# Altium project ESP32_breakout.PrjPcb
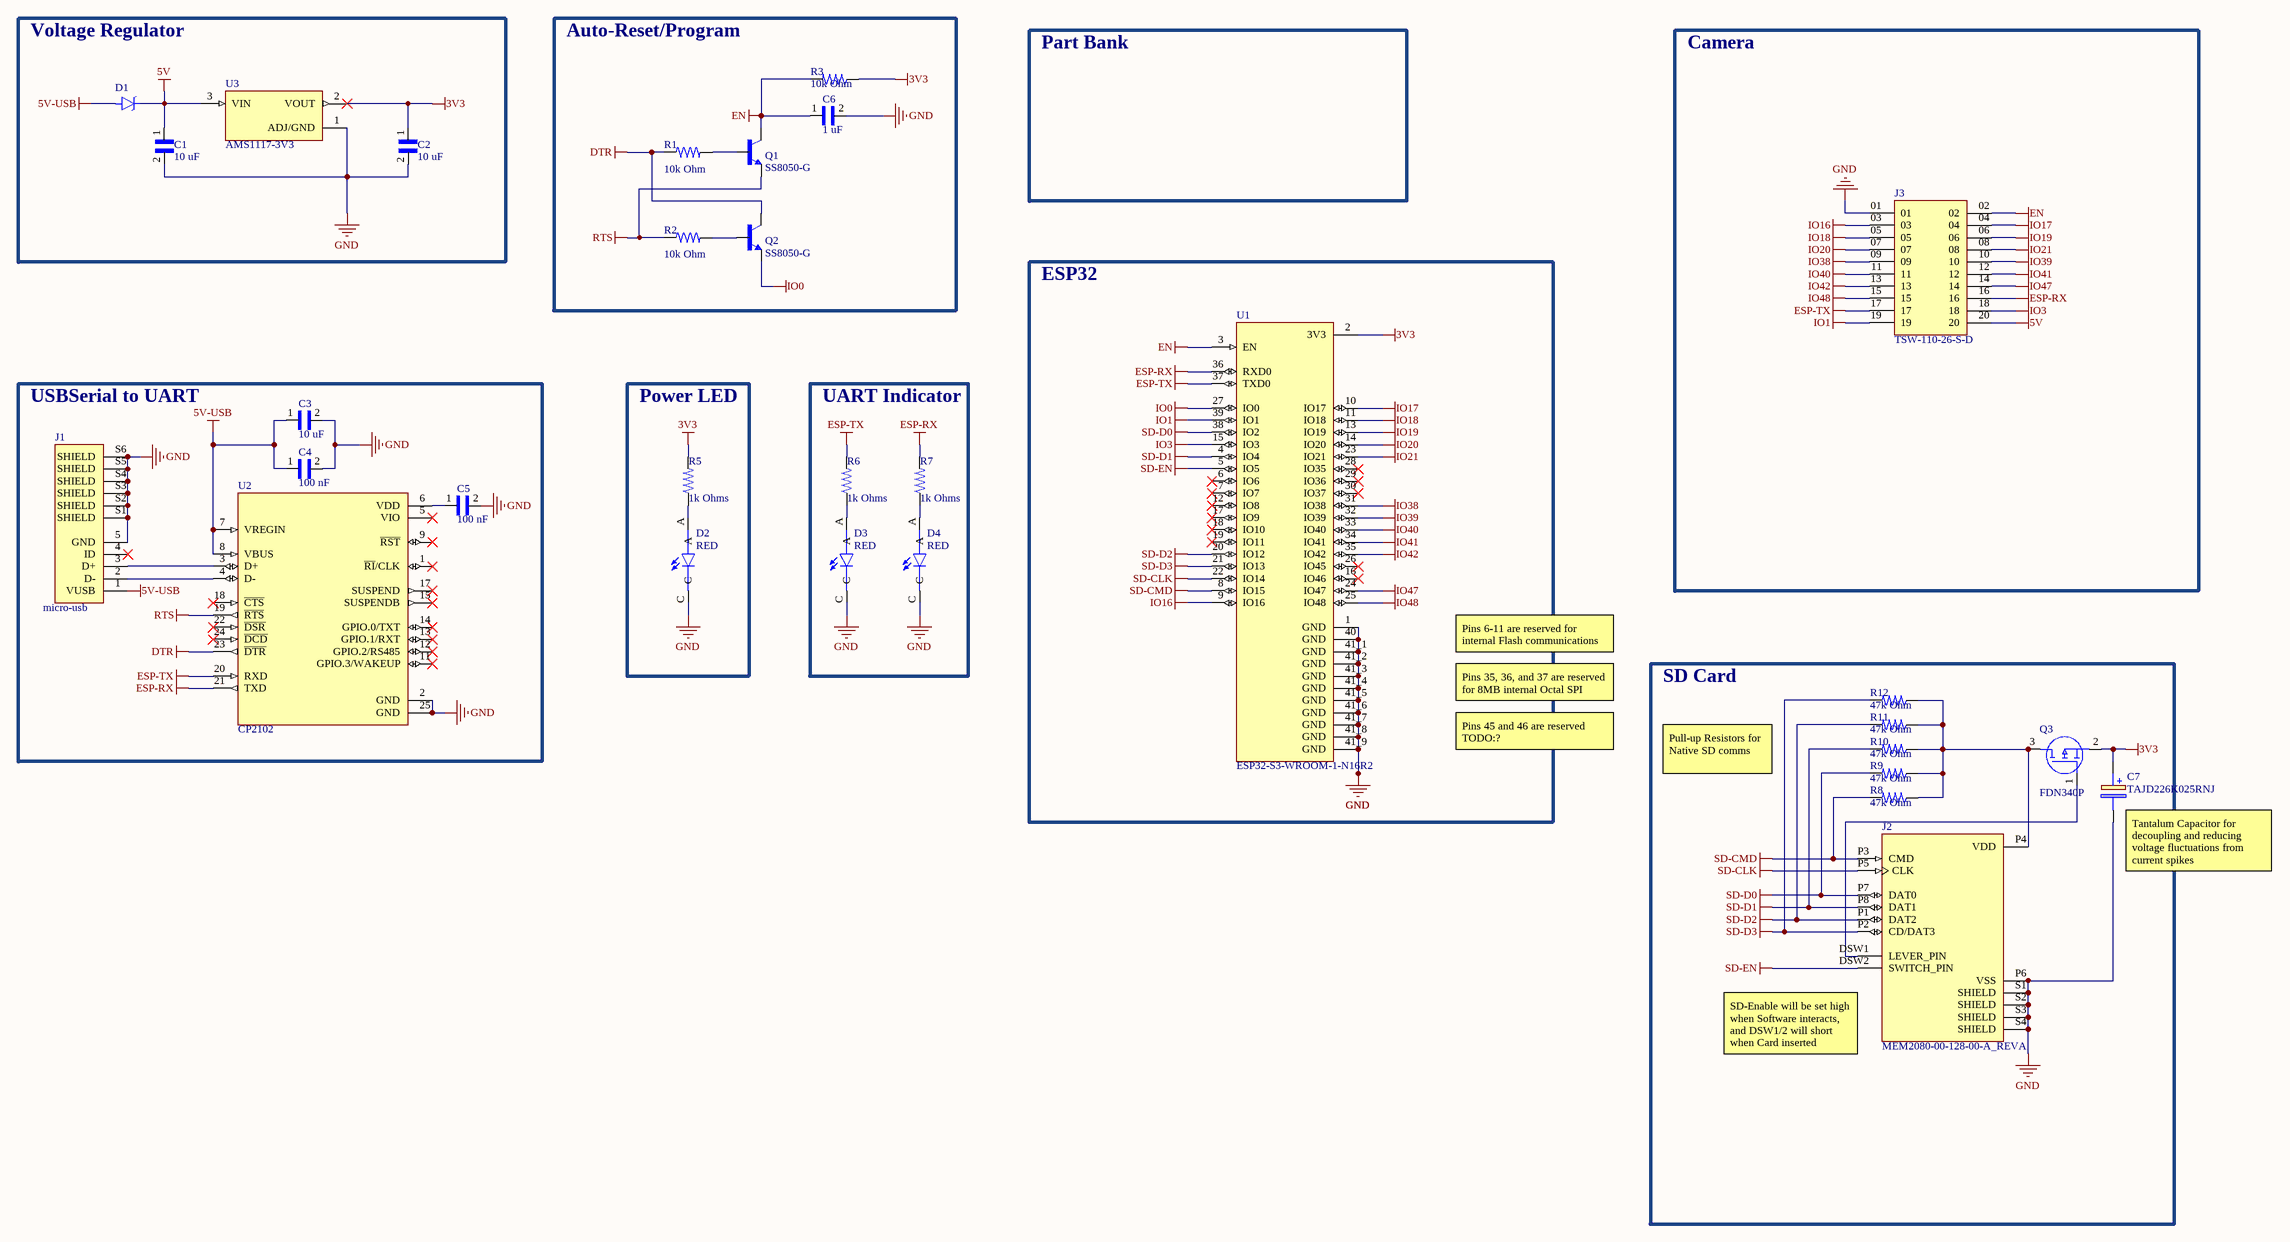
[diagram p0: ESP32_breakout.SchDoc]
1 sheet, 31 parts. Net scope: global (net labels, ports and power ports of the same name join across sheets).
Board file: ESP32_breakout.PcbDoc

## Sheet ESP32_breakout.SchDoc
size C; SPICEModelCacheHEPKSNLS: <root> / <DocumentId>HEPKSNLS</DocumentId> / </root>

### Parts
C1  10 uF  [CAPC1608X90]
C2  10 uF  [CAPC1608X90]
C3  10 uF  [CAPC1608X90]
C4  100 nF  [CAPC1608X90]
C5  100 nF  [CAPC1608X90]
C6  1 uF  [CAPC1608X90]
C7  TAJD226K025RNJ  [CAPPM7344X310N]
D1  (no value)  [SOD-323]
D2  RED  [LEDC3216X110]
D3  RED  [LEDC3216X110]
D4  RED  [LEDC3216X110]
J1  micro-usb  [AMPHENOL_10118193-0001LF]
J2  MEM2080-00-128-00-A_REVA  [GCT_MEM2080-00-128-00-A_REVA]
J3  TSW-110-26-S-D  [SAMTEC_TSW-110-26-S-D]
Q1  SS8050-G  [SOT95P240X111-3N]
Q2  SS8050-G  [SOT95P240X111-3N]
Q3  FDN340P  [SOT95P237X112-3N]
R1  10k Ohm  [RESC2012X65N]
R2  10k Ohm  [RESC2012X65N]
R3  10k Ohm  [RESC2012X65N]
R5  1k Ohms  [RESC2012X65N]
R6  1k Ohms  [RESC2012X65N]
R7  1k Ohms  [RESC2012X65N]
R8  47k Ohm  [RESC2012X65N]
R9  47k Ohm  [RESC2012X65N]
R10  47k Ohm  [RESC2012X65N]
R11  47k Ohm  [RESC2012X65N]
R12  47k Ohm  [RESC2012X65N]
U1  ESP32-S3-WROOM-1-N16R2  [XCVR_ESP32-S3-WROOM-1-N16R2]
U2  CP2102  [QFN50P400X400X80-25N]
U3  AMS1117-3V3  [SOT229P700X180-4N]

### Blocks framed on the sheet
Voltage Regulator: C1 C2 D1 U3
Auto-Reset/Program: C6 Q1 Q2 R1-R3
Camera: J3
ESP32: U1
USBSerial to UART: C3-C5 J1 U2
Power LED: D2 R5
UART Indicator: D3 D4 R6 R7
SD Card: C7 J2 Q3 R8-R12

### Nets
3V3: C2.1 C7.1(+) Q3.2(S) R3.1 R5.2 U1.2(3V3) U3.2(VOUT)
5V: C1.1 D1.C J3.20 U3.3(VIN)
5V-USB: C3.1 C4.1 D1.A J1.1(VUSB) U2.7(VREGIN) U2.8(VBUS)
DTR: Q2.3(C) R1.1 U2.23(~{DTR})
EN: C6.1 J3.02 Q1.3(C) R3.2 U1.3(EN)
ESP-RX: J3.16 R7.2 U1.36(RXD0) U2.21(TXD)
ESP-TX: J3.17 R6.2 U1.37(TXD0) U2.20(RXD)
GND: C1.2 C2.2 C3.2 C4.2 C5.2 C6.2 C7.2(-) D2.C D3.C D4.C J1.5(GND) J1.S1(SHIELD) J1.S2(SHIELD) J1.S3(SHIELD) J1.S4(SHIELD) J1.S5(SHIELD) J1.S6(SHIELD) J2.P6(VSS) J2.S1(SHIELD) J2.S2(SHIELD) J2.S3(SHIELD) J2.S4(SHIELD) J3.01 U1.1(GND) U1.40(GND) U1.41_1(GND) U1.41_2(GND) U1.41_3(GND) U1.41_4(GND) U1.41_5(GND) U1.41_6(GND) U1.41_7(GND) U1.41_8(GND) U1.41_9(GND) U2.2(GND) U2.25(GND) U3.1(ADJ/GND)
IO0: Q2.2(E) U1.27(IO0)
IO1: J3.19 U1.39(IO1)
IO3: J3.18 U1.15(IO3)
IO16: J3.03 U1.9(IO16)
IO17: J3.04 U1.10(IO17)
IO18: J3.05 U1.11(IO18)
IO19: J3.06 U1.13(IO19)
IO20: J3.07 U1.14(IO20)
IO21: J3.08 U1.23(IO21)
IO38: J3.09 U1.31(IO38)
IO39: J3.10 U1.32(IO39)
IO40: J3.11 U1.33(IO40)
IO41: J3.12 U1.34(IO41)
IO42: J3.13 U1.35(IO42)
IO47: J3.14 U1.24(IO47)
IO48: J3.15 U1.25(IO48)
RTS: Q1.2(E) R2.1 U2.19(~{RTS})
SD-CLK: J2.P5(CLK) U1.22(IO14)
SD-CMD: J2.P3(CMD) R8.2 U1.8(IO15)
SD-D0: J2.P7(DAT0) R9.2 U1.38(IO2)
SD-D1: J2.P8(DAT1) R10.2 U1.4(IO4)
SD-D2: J2.P1(DAT2) R11.2 U1.20(IO12)
SD-D3: J2.P2(CD/DAT3) R12.2 U1.21(IO13)
SD-EN: J2.DSW2(SWITCH_PIN) U1.5(IO5)
NetC5_1: C5.1 U2.6(VDD)
NetD2_A: D2.A R5.1
NetD3_A: D3.A R6.1
NetD4_A: D4.A R7.1
NetJ1_2: J1.2(D-) U2.4(D-)
NetJ1_3: J1.3(D+) U2.3(D+)
NetJ2_DSW1: J2.DSW1(LEVER_PIN) Q3.1(G)
NetJ2_P4: J2.P4(VDD) Q3.3(D) R8.1 R9.1 R10.1 R11.1 R12.1
NetQ1_1: Q1.1(B) R1.2
NetQ2_1: Q2.1(B) R2.2

Not connected (* = marked no-connect by the designer): J1 4(ID)*; U1 6(IO6)* 7(IO7)* 12(IO8)* 16(IO46)* 17(IO9)* 18(IO10)* 19(IO11)* 26(IO45)* 28(IO35)* 29(IO36)* 30(IO37)*; U2 1(~{RI}/CLK)* 5(VIO)* 9(~{RST})* 11(GPIO.3/WAKEUP)* 12(GPIO.2/RS485)* 13(GPIO.1/RXT)* 14(GPIO.0/TXT)* 15(SUSPENDB)* 17(SUSPEND)* 18(~{CTS})* 22(~{DSR})* 24(~{DCD})*

### Notes on the sheet
- Part Bank
- Pins 6-11 are reserved for internal Flash communications
- Pins 35, 36, and 37 are reserved for 8MB internal Octal SPI PSRAM
- Pins 45 and 46 are reserved TODO:?
- Pull-up Resistors for Native SD comms
- (near C7) Tantalum Capacitor for decoupling and reducing voltage fluctuations from current spikes
- (near J2) SD-Enable will be set high when Software interacts, and DSW1/2 will short when Card inserted

### Library data of the parts
C1-C6 = LD03ZD475MAB2A: COMMERCIAL CHIP STD JAPAN BULK - FN TAPE/REEL, 7 INCH PAPER TAPE; Package: None; Price: None; Value: *; MP: LD03ZD475MAB2A; Availability: Unavailable
C7 = TAJD226K025RNJ: TAJ SMT tant capacitor,Case D,25V,22uF AVX +/-10% 22uF 25 V dc SMD Tantalum Electrolytic Capacitor, 7343-31 ESR 900m +125C TAJ; Geometry.Height: 3.1mm; Mouser Part Number: 581-TAJD226K025R; Mouser Price/Stock: https://www.mouser.co.uk/ProductDetail/AVX/TAJD226K025RNJ?qs=min0%252Bk%2FlUAa%252BdXCotYsVZg%3D%3D; Manufacturer_Name: AVX; Manufacturer_Part_Number: TAJD226K025RNJ; Datasheet Link: http://datasheets.avx.com/TAJ.pdf
D1 = BAT20JFILM: Diode Schottky 23V 1A Surface Mount SOD-323; MF: STMicroelectronics; Package: SOD-323 STMicroelectronics; SnapEDA_Link: https://www.snapeda.com/parts/BAT20JFILM/STMicroelectronics/view-part/110314/?ref=snap; MP: BAT20JFILM; Value: *; Availability: Unavailable; Price: None
D2-D4 = LTST-C230KFKT: Orange 605nm LED Indication - Discrete 2V 1206 (3216 Metric); MF: Lite-On Inc.; Package: 1206 Lite-On; Price: None; Check_prices: https://www.snapeda.com/parts/LTST-C230KFKT/Lite-On+Inc./view-part/?ref=eda; Value: *; SnapEDA_Link: https://www.snapeda.com/parts/LTST-C230KFKT/Lite-On+Inc./view-part/?ref=snap; MP: LTST-C230KFKT; Availability: In Stock; Purchase-URL: https://pricing.snapeda.com/search?q=LTST-C230KFKT&ref=eda
J1 = 10118193-0001LF: Micro USB 2.0, Input Output Connectors, B TYPE RECEPTACLE; MF: Amphenol ICC; Value: *; MP: 10118193-0001LF; Package: None; Check_prices: https://www.snapeda.com/parts/10118193-0001LF/Amphenol+FCI/view-part/?ref=eda; Purchase-URL: https://pricing.snapeda.com/search/part/10118193-0001LF/?ref=eda; Price: None; Availability: In Stock; SnapEDA_Link: https://www.snapeda.com/parts/10118193-0001LF/Amphenol+FCI/view-part/?ref=snap
J2 = MEM2080-00-128-00-A_REVA: 9 (8 + 1) Position Card Connector Secure Digital - microSDâ„¢ Surface Mount, Right Angle Gold; MF: Global Connector Technology; Check_prices: https://www.snapeda.com/parts/MEM2080-00-128-00-A/Global+Connector+Technology/view-part/?ref=eda; Value: *; Availability: In Stock; MP: MEM2080-00-128-00-A; Price: None; Package: None; SnapEDA_Link: https://www.snapeda.com/parts/MEM2080-00-128-00-A/Global+Connector+Technology/view-part/?ref=snap; Purchase-URL: https://pricing.snapeda.com/search/part/MEM2080-00-128-00-A/?ref=eda
Q1 Q2 = SS8050-G: Bipolar (BJT) Transistor NPN 25 V 1.5 A 100MHz 300 mW Surface Mount SOT-23-3; MP: SS8050G; MF: Comchip; Digi-Key_Part_Number: 641-1790-2-ND; Check_prices: https://www.snapeda.com/parts/SS8050G/Comchip/view-part/?ref=eda; Package: None; SnapEDA_Link: https://www.snapeda.com/parts/SS8050G/Comchip/view-part/?ref=snap; Value: *
Q3 = FDN340P: Trans MOSFET P-CH 20V 2A 3-Pin SuperSOT; Manufacturer_Name: onsemi; Geometry.Height: 1.12mm; Mouser Part Number: 512-FDN340P; Mouser Price/Stock: https://www.mouser.co.uk/ProductDetail/onsemi-Fairchild/FDN340P?qs=AMp2PTjoga9dhzFXRaqTZw%3D%3D; Manufacturer_Part_Number: FDN340P; Datasheet Link: https://www.onsemi.com/pub/Collateral/FDN340P-D.PDF
R1 R2 = 1676221-2: RES SMD 1K OHM 0.1% 1/10W 0805; Tolerance: .1%; Power_Rating: .1 W; Voltage_Rating: 100 V; MF: TE Connectivity; Resistance: 1K; SnapEDA_Link: https://www.snapeda.com/parts/1676221-2/TE+Connectivity/view-part/?ref=snap; Package: 0805; MP: 1676221-2; Check_prices: https://www.snapeda.com/parts/1676221-2/TE+Connectivity/view-part/?ref=eda; Price: None; EU_RoHS_Compliance: Compliant; Value: *; Availability: In Stock
R3 R5-R12 = 1676221-2: RES SMD 1K OHM 0.1% 1/10W 0805; Power_Rating: .1 W; Voltage_Rating: 100 V; MF: TE Connectivity; Tolerance: .1%; SnapEDA_Link: https://www.snapeda.com/parts/1676221-2/TE+Connectivity/view-part/?ref=snap; Package: 0805; MP: 1676221-2; Resistance: 1K; Check_prices: https://www.snapeda.com/parts/1676221-2/TE+Connectivity/view-part/?ref=eda; Price: None; EU_RoHS_Compliance: Compliant; Value: *; Availability: In Stock
U1 = ESP32-S3-WROOM-1-N16R2: Bluetooth, WiFi 802.11b/g/n, Bluetooth v5.0 Transceiver Module 2.4GHz PCB Trace Surface Mount; MF: Espressif Systems; Package: None; Availability: In Stock; SnapEDA_Link: https://www.snapeda.com/parts/ESP32-S3-WROOM-1-N16R2/Espressif+Systems/view-part/?ref=snap; MP: ESP32-S3-WROOM-1-N16R2; Value: *; Purchase-URL: https://pricing.snapeda.com/search/part/ESP32-S3-WROOM-1-N16R2/?ref=eda; Price: None; Check_prices: https://www.snapeda.com/parts/ESP32-S3-WROOM-1-N16R2/Espressif+Systems/view-part/?ref=eda
U2 = CP2102N-A02-GQFN24R: Value: *; MP: CP2102N-A02-GQFN24R; Package: None; Availability: Unavailable; Price: None
U3 = AMS1117-3.3: Sot223/Pkg 1-Amp 3.3-Volt Low Drop Out Voltage Regulatator; MF: Advanced Monolithic Systems; Price: None; Package: None; Value: *; MP: AMS1117-3.3; Availability: Unavailable; SnapEDA_Link: https://www.snapeda.com/parts/AMS1117-3.3/Advanced%20Monolithic%20Systems/view-part/53450/?ref=snap
J3 = TSW-110-26-S-D: Package: None; Price: None; Value: *; MP: TSW-110-26-S-D; Availability: Unavailable